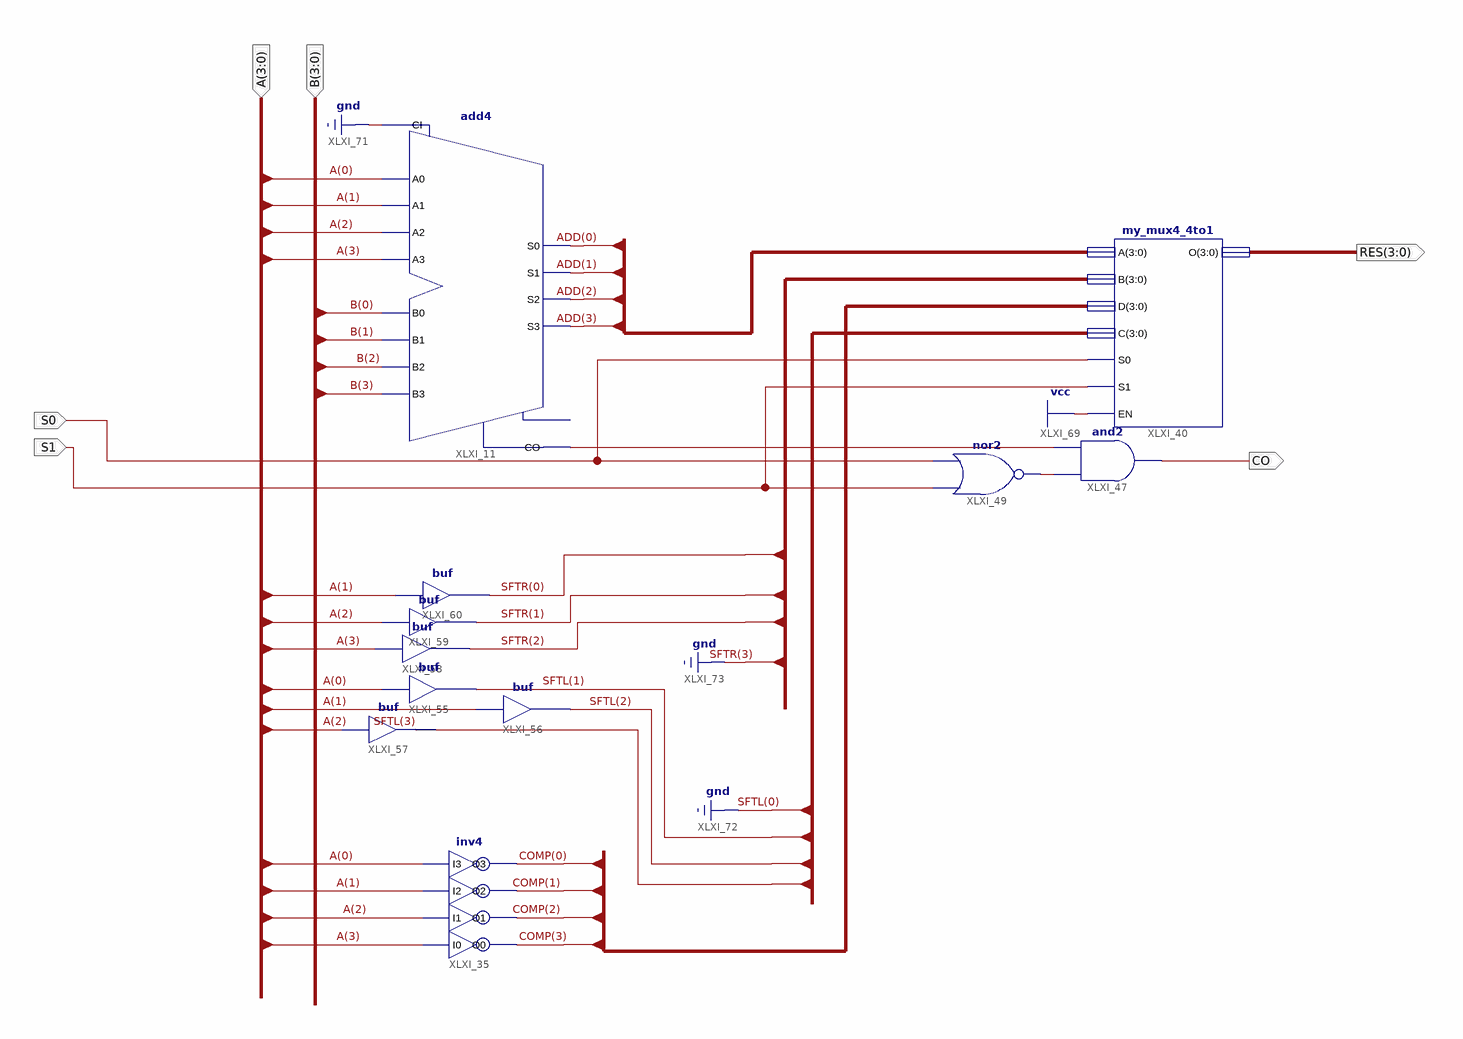
[diagram p0: schematic sheet 1]
// Xilinx ISE schematic my_alu.sch (virtex6) as structural Verilog: 11 symbols, 6 ports
module my_alu (
  input  [3:0] B,
  input  [3:0] A,
  input  S1,
  input  S0,
  output [3:0] RES,
  output CO
);

  wire XLXN_129, XLXN_131;
  wire [2:0] SFTR;
  wire [3:0] ADD, COMP;
  wire [3:1] SFTL;

  inv4 XLXI_35 (.I0(A[3]), .I1(A[2]), .I2(A[1]), .I3(A[0]), .O0(COMP[3]), .O1(COMP[2]), .O2(COMP[1]), .O3(COMP[0]));
  my_mux4_4to1 XLXI_40 (.S1(S1), .EN(1'b1), .S0(S0), .A(ADD), .B({1'b0, SFTR}), .D(COMP), .C({SFTL, 1'b0}), .O(RES));
  and XLXI_47 (CO, XLXN_131, XLXN_129);
  nor XLXI_49 (XLXN_131, S1, S0);
  add4 XLXI_11 (
    .A0(A[0]), .A1(A[1]), .A2(A[2]), .A3(A[3]), .B0(B[0]), .B1(B[1]), .B2(B[2]), .B3(B[3]), .CI(1'b0),
    .CO(XLXN_129), .S0(ADD[0]), .S1(ADD[1]), .S2(ADD[2]), .S3(ADD[3]));  // open: OFL
  buf XLXI_56 (SFTL[2], A[1]);
  buf XLXI_57 (SFTL[3], A[2]);
  buf XLXI_58 (SFTR[2], A[3]);
  buf XLXI_59 (SFTR[1], A[2]);
  buf XLXI_60 (SFTR[0], A[1]);
  buf XLXI_55 (SFTL[1], A[0]);
endmodule
